# Altium schematic sheet OUTPUT.SchDoc
size A4; SheetNumber: 11; SheetTotal: 12
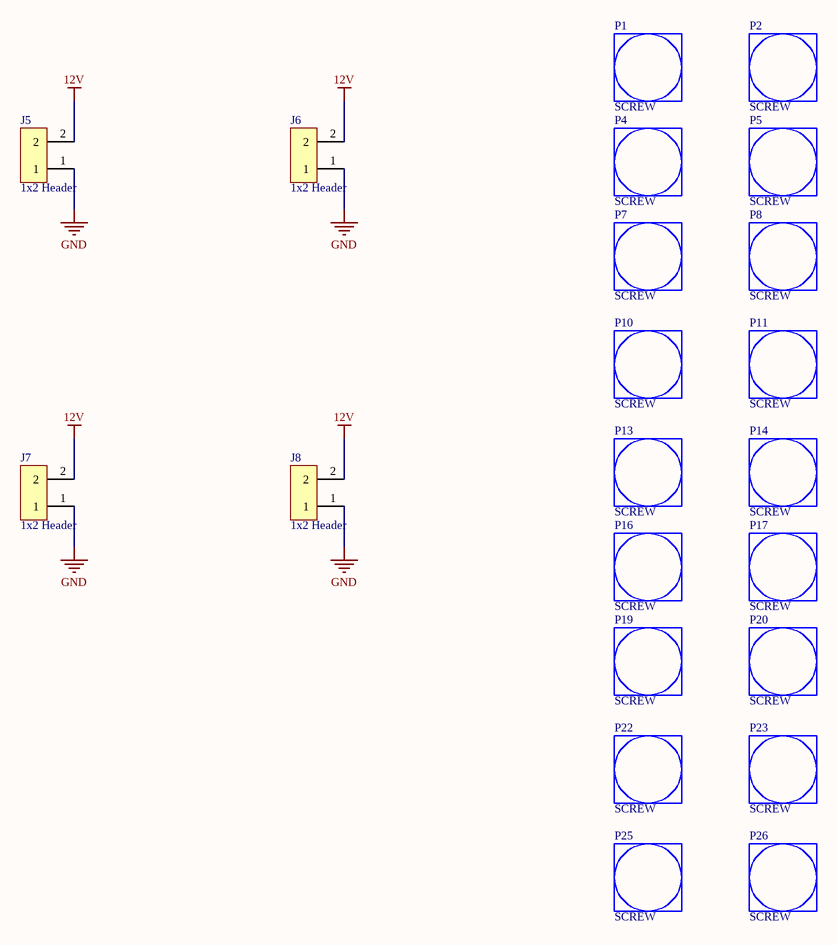
[diagram p0: OUTPUT.SchDoc]

## Parts
J5  1x2 Header  [HDR1*2]
J6  1x2 Header  [HDR1*2]
J7  1x2 Header  [HDR1*2]
J8  1x2 Header  [HDR1*2]
P1  SCREW  [PICH]
P2  SCREW  [PICH]
P4  SCREW  [PICH]
P5  SCREW  [PICH]
P7  SCREW  [PICH]
P8  SCREW  [PICH]
P10  SCREW  [PICH]
P11  SCREW  [PICH]
P13  SCREW  [PICH]
P14  SCREW  [PICH]
P16  SCREW  [PICH]
P17  SCREW  [PICH]
P19  SCREW  [PICH]
P20  SCREW  [PICH]
P22  SCREW  [PICH]
P23  SCREW  [PICH]
P25  SCREW  [PICH]
P26  SCREW  [PICH]

## Nets
12V: J5.2 J6.2 J7.2 J8.2
GND: J5.1 J6.1 J7.1 J8.1

## Library data of the parts
J5-J8 = HDR1*2: Headers & Wire Housings 2 PIN F/LK HEADER; Manufacturer: Molex; Number of Positions: 2; Gender: Male; Contact Resistance: 10mR; Current Rating: 4A; Voltage Rating: 250V; Pitch: 2.54mm; Glow Wire Compliant: Non-compliant; Supplier 1: Digi-Key; Manufacturer Part Number: 22-29-2021; Stock 1: 17589; Pricing 1: 1=0.46, 10=0.431, 100=0.3014, 500=0.2583, 1000=0.21525, 5000=0.1845, 10000=0.1722 (USD); Mount: Through Hole; Housing Colour: White; Colour: White; Housing Material: Nylon; Contact Plating: Gold; Contact Material: Brass; Min Operating Temperature: 0°C; Max Operating Temperature: 75°C; Number of Rows: 1; Packaging: Bulk; Termination: Through Hole; Orientation: Straight; Number of Contacts: 2; Package Quantity: 2500; Number of Circuits: 2; Max Current Rating: 4A; Max Voltage Rating (AC): 250V; Voltage Rating (DC): 250V; Length: 12.7mm; Height: 11.7mm; Depth: 5.8mm; Radiation Hardening: No; Lead Free: Lead Free; REACH SVHC: Unknown; Halogen Free: Low Halogen; Flammability Rating: UL94 V-0; ComponentLink1URL: https://datasheet.ciiva.com/30169/113840022292021-pcb-headers-30169888.pdf; ComponentLink1Description: https://datasheet.ciiva.com/30169/113840022292021-pcb-headers-30169888.pdf; ComponentLink2URL: https://datasheet.ciiva.com/19472/879588-19472951.pdf; ComponentLink2Description: https://datasheet.ciiva.com/19472/879588-19472951.pdf; ComponentLink3URL: https://datasheet.ciiva.com/11752/0900766b80d5fb7a-11752634.pdf; ComponentLink3Description: https://datasheet.ciiva.com/11752/0900766b80d5fb7a-11752634.pdf; ComponentLink4URL: https://datasheet.ciiva.com/5153/0022292021-pcb-headers-159390-5153053.pdf; ComponentLink4Description: https://datasheet.ciiva.com/5153/0022292021-pcb-headers-159390-5153053.pdf; ComponentLink5URL: https://datasheet.ciiva.com/9468/0022292021-pcb-headers-9468301.pdf; ComponentLink5Description: https://datasheet.ciiva.com/9468/0022292021-pcb-headers-9468301.pdf; ComponentLink6URL: https://datasheet.ciiva.com/25908/0022292021-pcb-headers-25908286.pdf; ComponentLink6Description: https://datasheet.ciiva.com/25908/0022292021-pcb-headers-25908286.pdf; Supplier Part Number 1: WM2744-ND; Category: Connectors
P1 P2 P4 P5 P7 P8 P10 P11 P13 P14 P16 P17 P19 P20 P22 P23 P25 P26 = PICH